# Altium schematic sheet Load_Cell_Biasing.SchDoc
size A3; Organization: Altium Limited; Address1: L3, 12a Rodborough Rd; Address2: Frenchs Forest; Address3: NSW; Address4: Australia 2086; DocumentNumber: 3; SheetNumber: 3; SheetTotal: 8
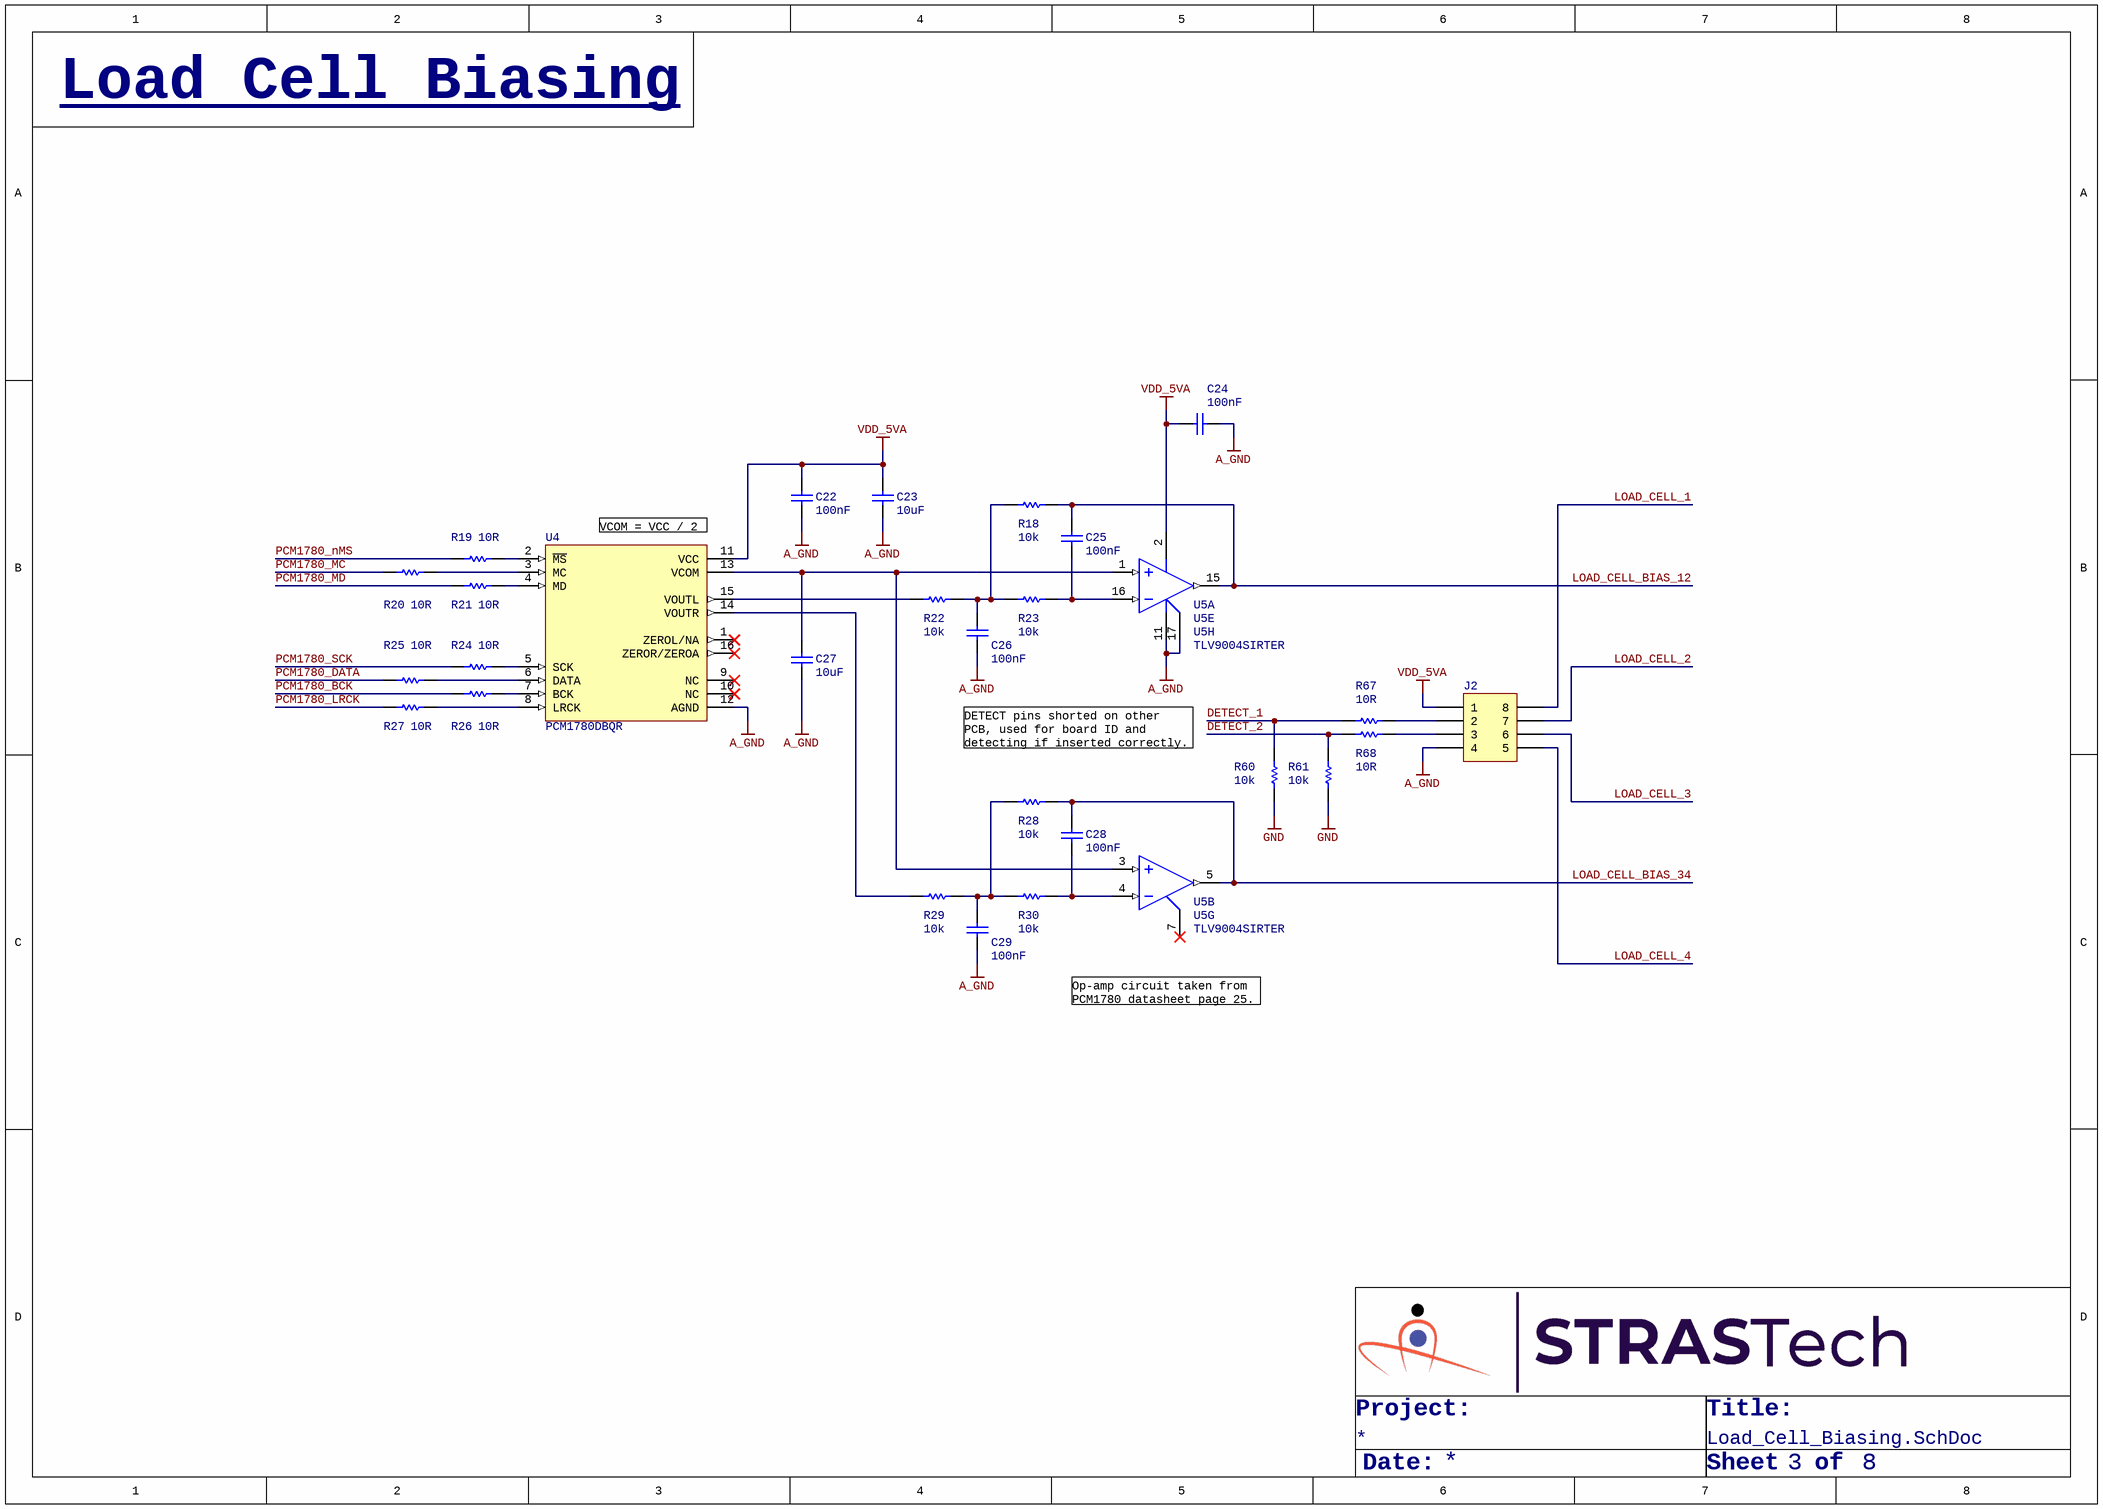
[diagram p0: Load_Cell_Biasing.SchDoc]

## Parts
C22  100nF  [Cap,SMD,0402]
C23  10uF  [Cap,SMD,0402]
C24  100nF  [Cap,SMD,0402]
C25  100nF  [Cap,SMD,0402]
C26  100nF  [Cap,SMD,0402]
C27  10uF  [Cap,SMD,0402]
C28  100nF  [Cap,SMD,0402]
C29  100nF  [Cap,SMD,0402]
J2  Conn,Spring,Piston,8Pos,Thru  [Conn,Spring,Piston,8Pos,Thru]  (value not drawn)
R18  10k  [RES,0402]
R19  10R  [RES,0402]
R20  10R  [RES,0402]
R21  10R  [RES,0402]
R22  10k  [RES,0402]
R23  10k  [RES,0402]
R24  10R  [RES,0402]
R25  10R  [RES,0402]
R26  10R  [RES,0402]
R27  10R  [RES,0402]
R28  10k  [RES,0402]
R29  10k  [RES,0402]
R30  10k  [RES,0402]
R60  10k  [RES,0402]
R61  10k  [RES,0402]
R67  10R  [RES,0402]
R68  10R  [RES,0402]
U4  PCM1780DBQR  [IC,TSSOP-16,W3.9,P0.635MM]
U5  TLV9004SIRTER  [IC,QFN-16,3x3]  (parts A,B,E,G,H of 8)

## Nets
A_GND: C22.1 C23.1 C24.1 C26.1 C27.2 C29.1 J2.4 U4.12(AGND) U5.11(V-) U5.17(PAD)
GND: R60.1 R61.1
VDD_5VA: C22.2 C23.2 C24.2 J2.1 U4.11(VCC) U5.2(V+)
DETECT_1: R60.2 R67.1
DETECT_2: R61.2 R68.1
LOAD_CELL_1: J2.8
LOAD_CELL_2: J2.7
LOAD_CELL_3: J2.6
LOAD_CELL_4: J2.5
LOAD_CELL_BIAS_12: C25.2 R18.1 U5.15(OUT1)
LOAD_CELL_BIAS_34: C28.2 R28.1 U5.5(OUT2)
PCM1780_BCK: R26.1
PCM1780_DATA: R25.1
PCM1780_LRCK: R27.1
PCM1780_MC: R20.1
PCM1780_MD: R21.1
PCM1780_nMS: R19.1
PCM1780_SCK: R24.1
NetC25_1: C25.1 R23.2 U5.16(IN1-)
NetC26_2: C26.2 R18.2 R22.2 R23.1
NetC27_1: C27.1 U4.13(VCOM) U5.1(IN1+) U5.3(IN2+)
NetC28_1: C28.1 R30.2 U5.4(IN2-)
NetC29_2: C29.2 R28.2 R29.2 R30.1
NetJ2_2: J2.2 R67.2
NetJ2_3: J2.3 R68.2
NetR19_2: R19.2 U4.2(~{MS})
NetR20_2: R20.2 U4.3(MC)
NetR21_2: R21.2 U4.4(MD)
NetR22_1: R22.1 U4.15(VOUTL)
NetR24_2: R24.2 U4.5(SCK)
NetR25_2: R25.2 U4.6(DATA)
NetR26_2: R26.2 U4.7(BCK)
NetR27_2: R27.2 U4.8(LRCK)
NetR29_1: R29.1 U4.14(VOUTR)

Not connected (* = marked no-connect by the designer): U4 1(ZEROL/NA)* 9(NC)* 10(NC)* 16(ZEROR/ZEROA)*; U5 7(~{SHDN}34)*

## Notes on the sheet
- Load Cell Biasing
- (near U4) VCOM = VCC / 2
- DETECT pins shorted on other PCB, used for board ID and detecting if inserted correctly.
- Op-amp circuit taken from PCM1780 datasheet page 25.
- Project:
- Title:
- Date:
- Sheet
- of
- Title
- Size:
- A3
- Revision:
- Design By:

## Library data of the parts
C22 C24-C26 C28 C29 = CAP,Cer,100nF,25VDC,X7R,0402: 0.1µF ±10% 25V Ceramic Capacitor X7R 0402 (1005 Metric); Vendor Part Number: 490-14603-1-ND; Manufacturer: Murata Electronics; Manufacturer Part Number: GRM155R71E104KE14J; Vendor: Digikey; HelpURL: https://search.murata.co.jp/Ceramy/image/img/A01X/G101/ENG/GRM155R71E104KE14-01.pdf; CreatedBy: Judd Foster
C23 C27 = CAP,Cer,10uF,10VDC,X5R,0402: 10 µF ±20% 10V Ceramic Capacitor X5R 0402 (1005 Metric); Vendor Part Number: 1276-1450-1-ND; Manufacturer: Samsung Electro-Mechanics; Manufacturer Part Number: CL05A106MP5NUNC; Vendor: Digikey; HelpURL: https://media.digikey.com/pdf/Data%20Sheets/Samsung%20PDFs/CL05A106MP5NUNC_Spec.pdf; CreatedBy: Judd Foster
J2 = Conn,Spring,Piston,8Pos,Thru: 8 Position Spring Piston Connector Through Hole; Manufacturer: Mill-Max Manufacturing Corp.; Manufacturer Part Number: 823-22-008-10-002101; Vendor Part Number: ED8177-08-ND; Vendor: Digikey; CreatedBy: Judd Foster; HelpURL: https://www.mill-max.com/catalog/download/2019-08%3A013.pdf
R18 R22 R23 R28-R30 R60 R61 = RES,10k,5%,0.063W,0402: 10 kOhms ±5% 0.063W, 1/16W Chip Resistor 0402 (1005 Metric) Automotive AEC-Q200 Thick Film; Vendor Part Number: RMCF0402JT10K0CT-ND; Manufacturer: Stackpole Electronics Inc; Manufacturer Part Number: RMCF0402JT10K0; Vendor: DIgikey; HelpURL: https://www.seielect.com/catalog/sei-rmcf_rmcp.pdf; CreatedBy: Judd Foster
R19-R21 R24-R27 R67 R68 = RES,10R,1%,0.063W,0402: 10 Ohms ±1% 0.063W, 1/16W Chip Resistor 0402 (1005 Metric) Automotive AEC-Q200 Thick Film; Manufacturer: Panasonic Electronic Components; Manufacturer Part Number: ERJ-2RKF10R0X; Vendor Part Number: P10.0LCT-ND; Vendor: Digikey; CreatedBy: Judd Foster; HelpURL: https://industrial.panasonic.com/cdbs/www-data/pdf/RDA0000/AOA0000C304.pdf
U4 = PCM1780DBQR: DAC, Audio 24 b 200k I²S 16-SSOP; Manufacturer: Texas Instruments; Vendor Part Number: 296-41373-1-ND; Vendor: Digikey; Manufacturer Part Number: PCM1780DBQR; HelpURL: https://www.ti.com/general/docs/suppproductinfo.tsp?distId=10&gotoUrl=https%3A%2F%2Fwww.ti.com%2Flit%2Fgpn%2Fpcm1780; CreatedBy: Judd Foster
U5 = TLV9004SIRTER: General Purpose Amplifier 4 Circuit Rail-to-Rail 16-WQFN (3x3); Manufacturer: Texas Instruments; Vendor Part Number: 296-51829-1-ND; Vendor: Digikey; CreatedBy: Judd Foster; HelpURL: https://www.ti.com/general/docs/suppproductinfo.tsp?distId=10&gotoUrl=https%3A%2F%2Fwww.ti.com%2Flit%2Fgpn%2Ftlv9004; Manufacturer Part Number: TLV9004SIRTER